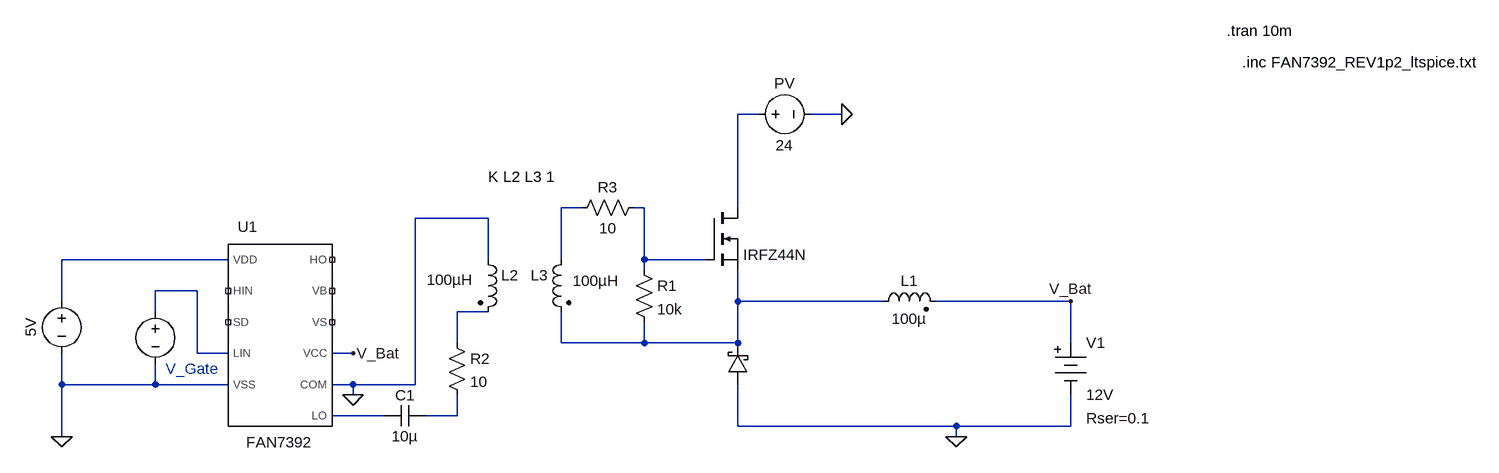
[diagram p0: schematic Gate drive transformer.asc]
Gate drive transformer.asc, the LTspice schematic file:
Version 4
SHEET 1 2080 680
WIRE 944 -176 912 -176
WIRE 1072 -176 1024 -176
WIRE 672 -32 640 -32
WIRE 768 -32 752 -32
WIRE 912 -32 912 -176
WIRE 528 -16 416 -16
WIRE 128 48 -128 48
WIRE 528 48 528 -16
WIRE 640 48 640 -32
WIRE 768 48 768 -32
WIRE 864 48 768 48
WIRE 768 64 768 48
WIRE 80 96 16 96
WIRE -128 112 -128 48
WIRE 912 112 912 64
WIRE 1136 112 912 112
WIRE 1424 112 1216 112
WIRE 16 128 16 96
WIRE 528 128 480 128
WIRE 480 176 480 128
WIRE 640 176 640 128
WIRE 768 176 768 144
WIRE 768 176 640 176
WIRE 912 176 912 112
WIRE 912 176 768 176
WIRE 1424 176 1424 112
WIRE 80 192 80 96
WIRE 128 192 80 192
WIRE 320 192 288 192
WIRE -128 240 -128 192
WIRE 16 240 16 208
WIRE 16 240 -128 240
WIRE 128 240 16 240
WIRE 320 240 288 240
WIRE 416 240 416 -16
WIRE 416 240 320 240
WIRE 320 256 320 240
WIRE 368 288 288 288
WIRE 480 288 480 256
WIRE 480 288 432 288
WIRE 912 304 912 240
WIRE 1248 304 912 304
WIRE 1424 304 1424 256
WIRE 1424 304 1248 304
WIRE -128 320 -128 240
WIRE 1248 320 1248 304
FLAG 1072 -176 0
FLAG -128 320 0
FLAG 1424 112 V_Bat
FLAG 320 192 V_Bat
FLAG 320 256 0
FLAG 1248 320 0
SYMBOL Gate\ drivers\\FAN7392 208 160 R0
SYMATTR InstName U1
SYMBOL nmos 864 -32 R0
WINDOW 0 56 32 Invisible 2
SYMATTR InstName M1
SYMATTR Value IRFZ44N
SYMBOL ind2 1120 128 R270
WINDOW 0 32 56 VTop 2
WINDOW 3 5 56 VBottom 2
SYMATTR InstName L1
SYMATTR Value 100µ
SYMATTR Type ind
SYMBOL voltage 928 -176 R270
WINDOW 0 32 56 VTop 2
WINDOW 3 -32 56 VBottom 2
WINDOW 123 0 0 Left 0
WINDOW 39 0 0 Left 0
SYMATTR InstName PV
SYMATTR Value 24
SYMBOL voltage -128 96 R0
WINDOW 0 32 56 Invisible 2
WINDOW 3 -32 56 VBottom 2
WINDOW 123 0 0 Left 0
WINDOW 39 0 0 Left 0
SYMATTR InstName V3
SYMATTR Value 5V
SYMBOL voltage 16 112 R0
WINDOW 0 24 16 Invisible 2
WINDOW 123 0 0 Left 0
WINDOW 39 0 0 Left 0
WINDOW 3 24 100 Invisible 2
SYMATTR InstName V4
SYMATTR Value PULSE(0 12 1n 1n 1n 11u 16u)
SYMBOL schottky 928 240 R180
WINDOW 0 24 64 Invisible 2
WINDOW 3 24 0 Invisible 2
SYMATTR InstName D2
SYMATTR Value SS3P5
SYMATTR Description Diode
SYMATTR Type diode
SYMBOL ind2 512 32 R0
WINDOW 3 -79 47 Left 2
SYMATTR InstName L2
SYMATTR Value 100µH
SYMATTR Type ind
SYMBOL ind2 656 32 M0
WINDOW 3 -73 48 Left 2
SYMATTR InstName L3
SYMATTR Value 100µH
SYMATTR Type ind
SYMBOL res 752 48 R0
SYMATTR InstName R1
SYMATTR Value 10k
SYMBOL cap 432 272 R90
WINDOW 0 0 32 VBottom 2
WINDOW 3 32 32 VTop 2
SYMATTR InstName C1
SYMATTR Value 10µ
SYMBOL Misc\\battery 1424 160 R0
WINDOW 123 0 0 Left 0
WINDOW 39 24 132 Left 2
SYMATTR InstName V1
SYMATTR Value 12V
SYMATTR SpiceLine Rser=0.1
SYMBOL res 464 160 R0
SYMATTR InstName R2
SYMATTR Value 10
SYMBOL res 768 -48 R90
WINDOW 0 0 56 VBottom 2
WINDOW 3 32 56 VTop 2
SYMATTR InstName R3
SYMATTR Value 10
TEXT 1664 -304 Left 2 !.tran 10m
TEXT 1688 -256 Left 2 !.inc FAN7392_REV1p2_ltspice.txt
TEXT 32 216 Left 2 ;V_Gate
TEXT 528 -80 Left 2 !K L2 L3 1

The netlist it stands for:
* Gate drive transformer.asc
XU1 V_Bat 0 NC_01 N005 N004 NC_02 NC_03 NC_04 0 NC_05 N008 FAN7392  ; pins VCC COM HIN LIN VDD VB VS HO VSS SD LO
M1 N001 N003 N006 N006 IRFZ44N
L1 N006 V_Bat 100µ
V§PV N001 0 24
V3 N004 0 5V
V4 N005 0 PULSE(0 12 1n 1n 1n 11u 16u)
D2 0 N006 SS3P5
L2 0 N007 100µH
L3 N002 N006 100µH
R1 N003 N006 10k
C1 N009 N008 10µ
V1 V_Bat 0 12V Rser=0.1
R2 N007 N009 10
R3 N003 N002 10
.model D D
.lib standard.dio
.model NMOS NMOS
.model PMOS PMOS
.lib standard.mos
.tran 10m
.inc FAN7392_REV1p2_ltspice.txt
* V_Gate
K L2 L3 1
.backanno
.end